# EAGLE board Analog_V7 (EAGLE 9.6.2)
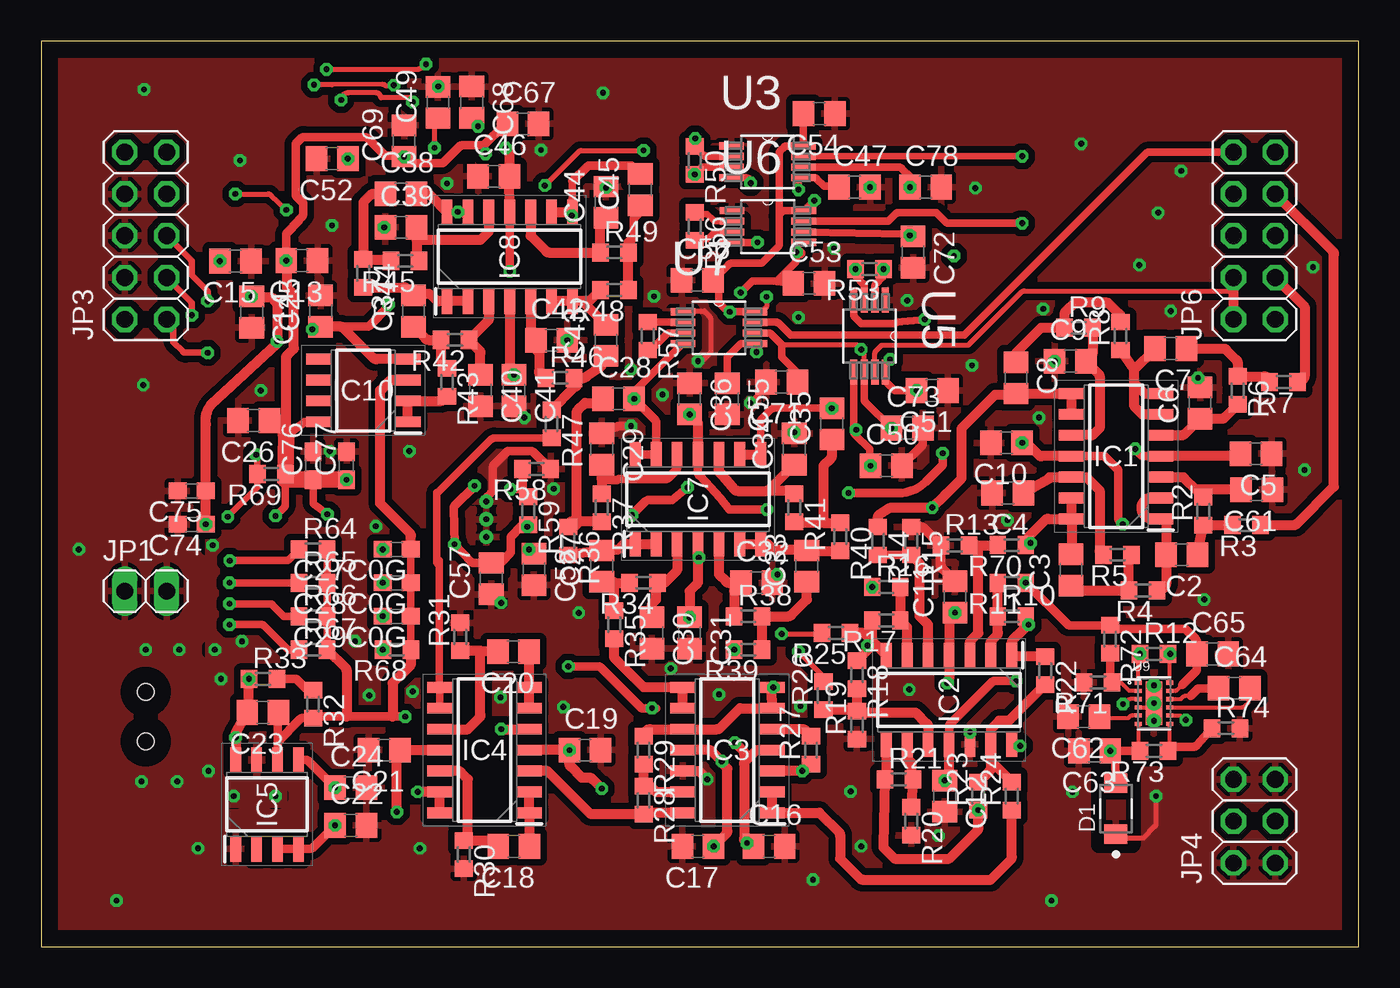
[diagram p1: board, top side]
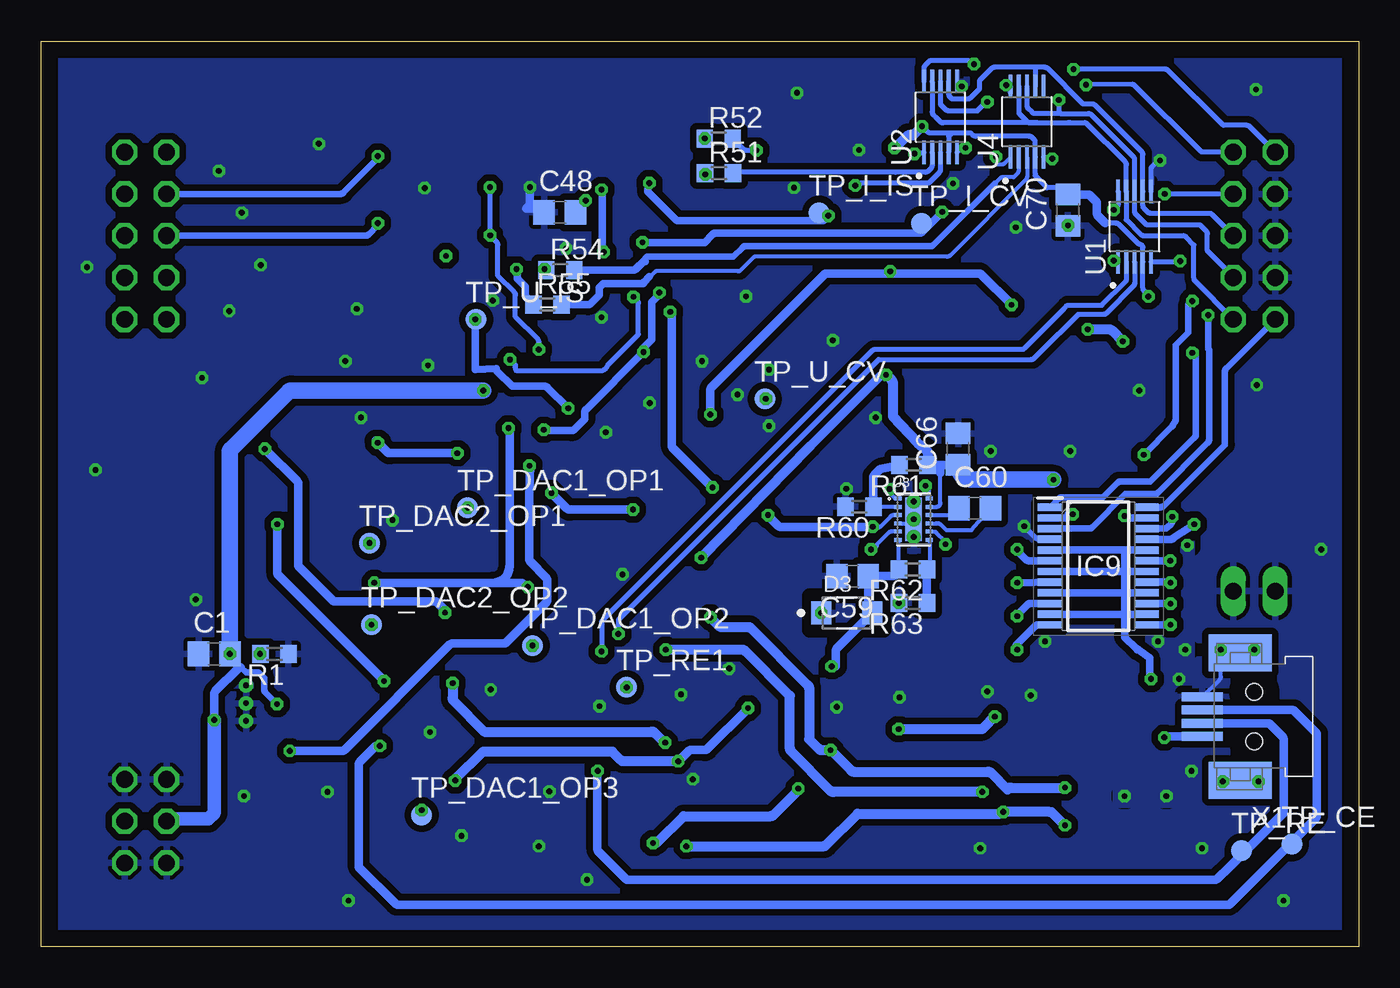
[diagram p2: board, bottom side, seen from below]

Size 80 x 55 mm. Coordinates in mm from the lower left corner, seen from the top.
Outline: 0,0 80,0 80,55 0,55 0,0
Copper layers (1*16): Top 0.035mm / dielectric 1.5mm / Bottom 0.035mm
Design rules "default": minimum track width 6mil, minimum drill 0.35mm, track to track 6mil, track to pad 6mil, pad to pad 6mil, via to via 6mil, smd to smd 6mil, copper to edge 40mil, drill to drill 6mil, minimum pad ring 10mil, minimum via ring 8mil, stop-mask expansion 4mil, vias tented up to drill 0mil, thermal gap 10mil

## Footprints (pad centres in the part's own frame; a part is rotated, then mirrored left to right if it is on the bottom)
C0805 = smd 1.3 x 1.5: 1 -0.95,0; 2 0.95,0
C0603 = smd 1.1 x 1: 1 -0.85,0; 2 0.85,0
ON_SEMICONDUCTOR_S310FA_0 = smd 1.2 x 1.4: 1 -1.55,0; 2 1.55,0
SOIC127P600X175-14N = smd 1.525 x 0.65: 1 -2.712,3.81; 2 -2.712,2.54; 3 -2.712,1.27; 4 -2.712,0; 5 -2.712,-1.27; 6 -2.712,-2.54; 7 -2.712,-3.81; 8 2.712,-3.81; 9 2.712,-2.54; 10 2.712,-1.27; 11 2.712,0; 12 2.712,1.27; 13 2.712,2.54; 14 2.712,3.81
SOIC127P600X175-8N = smd 1.525 x 0.65: 1 -2.712,1.905; 2 -2.712,0.635; 3 -2.712,-0.635; 4 -2.712,-1.905; 5 2.712,-1.905; 6 2.712,-0.635; 7 2.712,0.635; 8 2.712,1.905
SOP65P640X120-24N = smd 1.475 x 0.45: 1 -2.938,3.575; 2 -2.938,2.925; 3 -2.938,2.275; 4 -2.938,1.625; 5 -2.938,0.975; 6 -2.938,0.325; 7 -2.938,-0.325; 8 -2.938,-0.975; 9 -2.938,-1.625; 10 -2.938,-2.275; 11 -2.938,-2.925; 12 -2.938,-3.575; 13 2.938,-3.575; 14 2.938,-2.925; 15 2.938,-2.275; 16 2.938,-1.625; 17 2.938,-0.975; 18 2.938,-0.325; 19 2.938,0.325; 20 2.938,0.975; 21 2.938,1.625; 22 2.938,2.275; 23 2.938,2.925; 24 2.938,3.575
1X02 = drill 1.016 long: 1 -1.27,0; 2 1.27,0
2X05 = drill 1.016 octagon: 1 -5.08,-1.27; 2 -5.08,1.27; 3 -2.54,-1.27; 4 -2.54,1.27; 5 0,-1.27; 6 0,1.27; 7 2.54,-1.27; 8 2.54,1.27; 9 5.08,-1.27; 10 5.08,1.27
2X03 = drill 1.016 octagon: 1 -2.54,-1.27; 2 -2.54,1.27; 3 0,-1.27; 4 0,1.27; 5 2.54,-1.27; 6 2.54,1.27
R0603 = smd 1 x 1.1: 1 -0.85,0; 2 0.85,0
B1,27 = smd 1.27 x 1.27: TP 0,0
SOP50P490X110-10N = smd 1.44 x 0.3: 1 -2.145,1; 2 -2.145,0.5; 3 -2.145,0; 4 -2.145,-0.5; 5 -2.145,-1; 6 2.145,-1; 7 2.145,-0.5; 8 2.145,0; 9 2.145,0.5; 10 2.145,1
SOP65P490X110-8N = smd 1.499 x 0.432: 1 -2.184,0.965; 2 -2.184,0.33; 3 -2.184,-0.33; 4 -2.184,-0.965; 5 2.184,-0.965; 6 2.184,-0.33; 7 2.184,0.33; 8 2.184,0.965
VREG_LM27762DSSR = smd 0.5 x 0.25: 1 -0.95,1.25; 2 -0.95,0.75; 3 -0.95,0.25; 4 -0.95,-0.25; 5 -0.95,-0.75; 6 -0.95,-1.25; 7 0.95,-1.25; 8 0.95,-0.75; 9 0.95,-0.25; 10 0.95,0.25; 11 0.95,0.75; 12 0.95,1.25 | smd 1 x 2.65: 13 0,0 | drill 0.35 pad 0.61: 13.1 0,1.075; 13.2 0,0; 13.3 0,-1.075
32005-101 = smd 2.5 x 0.55: 1 3.15,1.2; 2 3.15,0.4; 3 3.15,-0.4; 4 3.15,-1.2 | smd 3.8 x 2.25: M1 0.85,3.875; M2 0.85,-3.875 | hole 1: 0,1.5; 0,-1.5

## Placement (x,y rotation side)
C1  Cvin  [C0805]  69.49,17.78 0 bottom
C2  110pF  [C0805]  69.25,23.8 180 top
C3  100pF  [C0805]  62.53,22.88 90 top
C4  10pF  [C0805]  58.68,27.56 180 top
C5  100nF  [C0805]  73.76,29.94 180 top
C6  11pF  [C0805]  70.36,33.02 90 top
C7  [C0805]  68.58,36.32 180 top
C8  100pF  [C0805]  59.18,34.54 270 top
C9  10pF  [C0805]  62.48,35.56 0 top
C10  100nF  [C0805]  58.61,30.6 180 top
C11  100nF  [C0805]  55.48,21.23 90 top
C12  100nF  [C0805]  54.86,9.14 270 top
C13  100nF  [C0805]  15.83,41.67 180 top
C14  100nF  [C0805]  12.78,38.54 270 top
C15  1uF  [C0805]  11.79,41.64 180 top
C16  100nF  [C0805]  44.2,6.1 0 top
C17  100nF  [C0805]  39.88,6.1 180 top
C18  100nF  [C0805]  28.7,6.1 180 top
C19  100nF  [C0805]  33.02,11.94 0 top
C20  100nF  [C0805]  28.68,17.91 180 top
C21  100nF  [C0805]  20.83,11.94 180 top
C22  100nF  [C0805]  18.8,7.37 0 top
C23  [C0805]  13.46,14.22 180 top
C24  100nF  [C0805]  18.8,9.65 0 top
C25  100nF  [C0805]  16.97,38.61 90 top
C26  [C0805]  12.9,31.95 180 top
C27  110PF  [C0805]  34.04,23.11 90 top
C27C0G  2.4nf  [C0603]  21.59,24.13 180 top
C28  100P  [C0805]  35.05,33.27 0 top
C28C0G  24pf  [C0603]  21.59,22.1 180 top
C29  10P  [C0805]  34.04,30.23 270 top
C29C0G  2.4p  [C0603]  21.59,20.07 180 top
C30  11pF  [C0805]  37.08,19.05 270 top
C31  100nF  [C0805]  39.37,19.05 270 top
C32  11pF  [C0805]  43.43,22.1 0 top
C33  110pF  [C0805]  46.48,23.11 90 top
C34  10pF  [C0805]  45.72,30.23 90 top
C35  100pF  [C0805]  48.01,31.75 90 top
C36  100nF  [C0805]  39.37,33.27 270 top
C37  110PF  [C0805]  22.61,38.61 90 top
C38  100P  [C0805]  21.84,45.72 0 top
C39  10P  [C0805]  21.84,43.69 0 top
C40  11pF  [C0805]  26.67,33.78 270 top
C41  100nF  [C0805]  28.7,33.78 270 top
C42  11pF  [C0805]  30.99,36.83 0 top
C43  110pF  [C0805]  34.29,36.83 90 top
C44  10pF  [C0805]  34.29,45.21 90 top
C45  100pF  [C0805]  36.37,45.97 90 top
C46  100nF  [C0805]  27.48,46.79 0 top
C47  100nF  [C0805]  49.38,46.13 0 top
C48  [C0805]  48.51,44.6 0 bottom
C49  1uF  [C0805]  24.09,51.27 90 top
C50  100nF  [C0805]  51.31,29.21 0 top
C51  [C0805]  54.1,33.78 180 top
C52  1uF  [C0805]  17.67,47.86 180 top
C53  100nF  [C0805]  46.61,40.28 0 top
C54  100nF  [C0805]  47.24,50.6 180 top
C55  100nF  [C0805]  41.66,33.27 270 top
C56  100nF  [C0805]  39.83,40.48 0 top
C57  Cvin  [C0805]  27.33,22.35 90 top
C58  [C0805]  29.92,22.91 270 top
C59  [C0805]  30.73,22.5 180 bottom
C60  [C0805]  23.32,26.62 0 bottom
C61  100nF  [C0805]  73.8,27.75 180 top
C62  [C0805]  63.3,13.97 180 top
C63  [C0805]  63.96,11.89 180 top
C64  [C0805]  72.44,15.7 0 top
C65  [C0805]  71.12,17.78 0 top
C66  [C0805]  24.33,30.23 90 bottom
C67  100nF  [C0805]  29.25,49.97 0 top
C68  100nF  [C0805]  26.14,51.29 270 top
C69  100nF  [C0805]  22.03,48.93 90 top
C70  100nF  [C0805]  17.67,44.74 90 bottom
C71  100nF  [C0805]  44.96,34.29 180 top
C72  100nF  [C0805]  52.93,42.19 270 top
C73  100nF  [C0805]  52.58,31.5 0 top
C74  0.1uf  [C0603]  9.14,25.65 180 top
C75  10uf  [C0603]  9.14,27.69 180 top
C76  0.1uf  [C0603]  16.51,29.21 90 top
C77  10uf  [C0603]  18.54,29.21 90 top
C78  100nF  [C0805]  53.7,46.13 0 top
D1  ON_SEMICONDUCTOR_S310FAON_SEMICONDUCTOR_S310FA_0_0  [ON_SEMICONDUCTOR_S310FA_0]  65.25,8.38 90 top
D3  ON_SEMICONDUCTOR_S310FAON_SEMICONDUCTOR_S310FA_0_0  [ON_SEMICONDUCTOR_S310FA_0]  31.09,20.27 0 bottom
IC1  AD8618ARZ  [SOIC127P600X175-14N]  65.27,29.79 180 top
IC2  AD8618ARZ  [SOIC127P600X175-14N]  55.12,14.99 270 top
IC3  AD8618ARZ  [SOIC127P600X175-14N]  41.66,11.94 180 top
IC4  AD8618ARZ  [SOIC127P600X175-14N]  26.92,11.94 180 top
IC5  ADA4530-1ARZ  [SOIC127P600X175-8N]  13.72,8.64 90 top
IC7  AD8618ARZ  [SOIC127P600X175-14N]  39.88,27.18 90 top
IC8  AD8618ARZ  [SOIC127P600X175-14N]  28.45,41.91 90 top
IC9  ADG714BRUZ  [SOP65P640X120-24N]  15.81,23.11 0 bottom
IC10  AD8616ARZ  [SOIC127P600X175-8N]  19.56,33.78 180 top
JP1  [1X02]  6.35,21.59 0 top
JP3  [2X05]  6.35,43.18 90 top
JP4  [2X03]  73.66,7.62 90 top
JP6  [2X05]  73.66,43.18 90 top
R1  0R  [R0603]  65.84,17.78 180 bottom
R2  93.1K  [R0603]  70.56,26.45 90 top
R3  2.67K  [R0603]  73.18,25.6 180 top
R4  4.22K  [R0603]  66.89,21.64 180 top
R5  57.6K  [R0603]  65.35,23.8 180 top
R6  93.1K  [R0603]  72.64,33.78 270 top
R7  2.67K  [R0603]  75.44,34.29 180 top
R8  4.22K  [R0603]  65.53,37.08 90 top
R9  57.6K  [R0603]  62.99,37.59 0 top
R10  1K  [R0603]  58.93,20.07 0 top
R11  1K  [R0603]  58.93,22.1 180 top
R12  Rpu  [R0603]  67.56,17.78 0 top
R13  1K  [R0603]  55.47,24.36 0 top
R14  1K  [R0603]  50.8,24.64 270 top
R15  1K  [R0603]  52.83,24.64 270 top
R16  1K  [R0603]  51.31,21.84 0 top
R17  1K  [R0603]  51.31,19.81 180 top
R18  1K  [R0603]  49.53,16.51 270 top
R19  1K  [R0603]  49.53,13.46 90 top
R20  1K  [R0603]  52.83,7.62 270 top
R21  1K  [R0603]  52.07,10.16 0 top
R22  1K  [R0603]  60.96,16.76 270 top
R23  1K  [R0603]  56.9,9.14 90 top
R24  1K  [R0603]  58.93,9.14 90 top
R25  0R  [R0603]  48.26,19.05 180 top
R26  0R  [R0603]  47.5,15.24 90 top
R27  0R  [R0603]  46.74,11.94 90 top
R28  [R0603]  36.58,8.89 270 top
R29  [R0603]  36.58,11.94 270 top
R30  1K  [R0603]  25.65,5.59 270 top
R31  1K  [R0603]  25.44,18.81 90 top
R32  10K  [R0603]  16.51,14.73 270 top
R33  10K  [R0603]  13.46,16.26 0 top
R34  93.1K  [R0603]  36.58,22.1 180 top
R35  2.67K  [R0603]  34.8,19.56 270 top
R36  4.22K  [R0603]  32,24.64 270 top
R37  57.6K  [R0603]  34.04,26.67 270 top
R38  93.1K  [R0603]  42.93,20.07 0 top
R39  2.67K  [R0603]  42.93,18.03 180 top
R40  4.22K  [R0603]  48.51,24.89 270 top
R41  57.6K  [R0603]  45.72,26.67 270 top
R42  93.1K  [R0603]  25.12,36.85 180 top
R43  2.67K  [R0603]  24.64,34.29 270 top
R44  4.22K  [R0603]  19.56,40.89 270 top
R45  57.6K  [R0603]  22.1,41.66 180 top
R46  93.1K  [R0603]  31.5,34.54 0 top
R47  2.67K  [R0603]  30.99,31.75 270 top
R48  4.22K  [R0603]  34.8,39.88 180 top
R49  57.6K  [R0603]  34.8,42.16 0 top
R50  1K  [R0603]  39.67,47.75 270 top
R51  0R  [R0603]  38.84,46.98 0 bottom
R52  0R  [R0603]  38.86,49.09 0 bottom
R53  1K  [R0603]  50.29,41.15 180 top
R54  0R  [R0603]  48.48,41.09 0 bottom
R55  0R  [R0603]  49.27,38.99 0 bottom
R56  1K  [R0603]  39.67,43.74 270 top
R57  1K  [R0603]  36.83,37.08 270 top
R58  0R  [R0603]  30.07,29.01 180 top
R59  Rpu  [R0603]  29.57,26.47 270 top
R60  [R0603]  30.33,26.72 180 bottom
R61  [R0603]  27.03,29.26 180 bottom
R62  [R0603]  27.08,22.91 180 bottom
R63  [R0603]  27.08,20.88 180 bottom
R64  100  [R0603]  16.51,24.13 0 top
R65  1k  [R0603]  16.51,22.1 0 top
R66  10k  [R0603]  16.51,20.07 0 top
R67  100k  [R0603]  16.51,18.03 0 top
R68  1M  [R0603]  21.59,18.03 180 top
R69  4.7k  [R0603]  13.97,28.7 180 top
R70  1K  [R0603]  58.93,24.38 180 top
R71  [R0603]  64.16,16.05 180 top
R72  [R0603]  64.9,18.67 270 top
R73  [R0603]  67.56,11.89 180 top
R74  [R0603]  71.94,13.26 0 top
TP_CE  TPB1,27  [B1,27]  4.06,6.22 0 bottom
TP_DAC1_OP1  TP_DAC1_OP1  [B1,27]  54.1,26.67 0 bottom
TP_DAC1_OP2  TPB1,27  [B1,27]  50.16,18.29 0 bottom
TP_DAC1_OP3  TPB1,27  [B1,27]  56.9,8 0 bottom
TP_DAC2_OP1  TP_DAC2_OP1  [B1,27]  60.07,24.51 0 bottom
TP_DAC2_OP2  TP_DAC2_OP2  [B1,27]  59.94,19.56 0 bottom
TP_I_CV  TPB1,27  [B1,27]  26.54,43.94 0 bottom
TP_I_IS  TPB1,27  [B1,27]  32.77,44.58 0 bottom
TP_RE  TPB1,27  [B1,27]  7.11,5.84 0 bottom
TP_RE1  TPB1,27  [B1,27]  44.45,15.75 0 bottom
TP_U_CV  TPB1,27  [B1,27]  36.07,33.27 0 bottom
TP_U_IS  TPB1,27  [B1,27]  53.59,38.1 0 bottom
U1  EVAL-AD5270SDZ  [SOP50P490X110-10N]  13.61,43.74 90 bottom
U2  EVAL-AD5270SDZ  [SOP50P490X110-10N]  25.4,50.39 90 bottom
U3  AD8421ARMZ  [SOP65P490X110-8N]  44.1,47.67 0 top
U4  EVAL-AD5270SDZ  [SOP50P490X110-10N]  20.15,50.11 90 bottom
U5  AD8421ARMZ  [SOP65P490X110-8N]  50.29,37.08 270 top
U6  AD8421ARMZ  [SOP65P490X110-8N]  44.12,43.74 0 top
U7  AD8421ARMZ  [SOP65P490X110-8N]  41.15,37.59 0 top
U8  LM27762DSSR  [VREG_LM27762DSSR]  27.03,25.96 0 bottom
U9  LM27762DSSR  [VREG_LM27762DSSR]  67.56,14.78 0 top
X1  MINI-USB_SHIELD4P-32005-101  [32005-101]  6.35,13.97 180 bottom

## Tracks (layer width: path | path; a pad name or v marks a point on that pad's centre or on a via)
+1.65V  (via drill 0.35)
  Top 0.254: U9.11 68.82,15.53 arc45 69,15.61 69.29,15.9
  Top 0.305: U5.6 49.96,36.04 arc45 49.89,36.22 | 49.89,36.22 49.58,36.52 45.09,36.52 arc45 44.96,36.47 | 49.89,36.22 arc-45 49.8,36.25 v49.79,36.27
  Top 0.457: C71.1 45.91,34.76 arc45 45.83,34.94 44.96,35.81 44.96,36.47 arc45 44.88,36.65 44.35,37.19 arc45 44.17,37.26 U7.6 | U5.6 49.96,33.27 arc45 50.04,33.09 C73.1 | U6.6 52.56,43.28 arc-45 v52.74,43.21 C72.1 | U3.6 52.07,47.34 arc-45 52.25,47.27 52.78,46.74 52.78,46.21 arc-45 C78.1
  Top 0.508: 69.29,15.9 70.1,16.7 arc45 70.17,16.88 C65.1 70.17,18.5 arc45 70.1,18.68 69.47,19.3 65.22,19.3 arc-45 65.04,19.38 R72.1 62.46,19.52 arc-45 62.28,19.59 R11.1
  Bottom 0.305: v49.79,36.27 49.79,36.73 arc-45 49.86,36.91 51.21,38.25 51.21,39.57 arc-45 51.28,39.75 52.27,40.74 52.27,42.62 arc-45 52.35,42.8 52.88,43.33 arc45 52.88,43.33 v52.74,43.21 52.74,46.16 arc45 52.73,46.18 arc-45 C78.1
  Bottom 0.508: R11.1 52.58,22.1 | 52.58,22.1 50.91,22.1 arc45 50.73,22.02 50.42,21.72 50.42,21.75 arc-45 R16.1 | 52.58,22.1 arc-90 51.56,23.11 51.56,31.5 C73.1
  other vias: 52.75,46.13 59.78,22.1 50.46,21.84 51.63,31.5
+2.5V  (via drill 0.35)
  Top 0.305: v26.98,48.16 26.98,48.46 arc45 26.9,48.64 26.87,48.67
  Top 0.457: v14.22,26.16 14.75,26.68 arc45 14.82,26.86 14.82,28.4 R69.1 | v17.37,26.26 16.58,26.85 arc-45 16.51,27.03 16.51,28.35 C76.1
  Top 0.508: IC5.5 16.05,11.35 arc-45 16.22,11.27 C24.1 | IC10.8 16.09,31.88 arc45 15.91,31.8 14.87,31.02 | C13.2 14.88,43.24 arc-45 14.94,43.38 15.61,44.06 arc45 15.65,44.15 15.83,44.33 arc45 15.9,44.5 15.9,45.16 15.52,45.54 arc-45 15.44,45.72 15.44,48.77 15.78,49.1 arc-45 15.96,49.17 19.66,49.17 arc-45 19.84,49.1 20.88,48.06 21.86,48.06 arc-45 C69.1 22.34,47.67 arc45 22.52,47.6 24.38,47.6 25.38,48.59 arc-45 25.56,48.67 26.87,48.67 28.11,49.9 arc-45 28.29,49.97 C67.1 | v39.93,23.62 arc-45 39.88,23.75 IC7.4 | IC1.4 66.96,29.79 arc-45 66.78,29.86 v66.42,30.23
  Top 0.61: C5.2 arc-90 72.66,29.79 IC1.4 | C11.1 55.19,20 arc45 55.12,19.82 IC2.4 55.12,16.26 arc-45 55.04,16.08 54.97,16 v55.02,16 | C16.1 v42.85,6.29 42.75,6.39 arc-45 42.67,6.57 42.67,11.07 | 42.67,11.07 arc-45 42.75,11.25 43.43,11.94 IC3.4 | IC4.4 C19.1 32.07,11.11 arc45 32.14,10.93 32.82,10.26 33.27,10.26 arc-45 33.45,10.19 v34.04,9.6 | IC8.4 28.45,35.09 arc45 28.52,34.91 C41.1 | C31.1 39.37,21.59 39.8,22.02 arc45 39.88,22.2 IC7.4 | v42.11,12.39 42.6,11.91 arc-45 42.67,11.73 42.67,11.07 | 14.87,31.02 14.87,35.75 arc-45 14.95,35.93 15.31,36.29 arc45 15.34,36.37 15.34,39.52 arc45 15.27,39.7 14.94,40.03 14.94,41.43 arc45 C13.2
  Top 1.016: C77.1 16.52,28.36 arc90 16.51,28.35 | C76.1 14.86,28.36 arc-90 14.82,28.4 | R69.1 14.87,31.02 arc90 C26.1
  Bottom 0.254: U8.11 25.65,26.71 arc-90 25.4,26.96 25.4,28.75 | U4.1 21.54,47.57 arc45 21.71,47.5 21.97,47.5 21.97,47.88 arc-45 22,47.95 C69.1
  Bottom 0.305: U1.1 arc-45 14.66,41.61 C13.2 | U2.1 arc45 26.5,48.21 27.03,48.21 v26.98,48.16
  Bottom 0.457: IC9.23 13.99,26.04 arc45 14.17,26.11 v14.22,26.16 | IC9.2 17.76,26.04 arc-45 17.58,26.11 17.63,26.26 v17.37,26.26
  Bottom 0.508: 25.4,28.75 25.4,29.01 arc-90 25.65,29.26 R61.1 24.35,29.26 arc-90 C66.1 | 33.32,30.38 29.05,34.66 arc45 28.87,34.73 C41.1 | v66.42,30.23 64.46,28.27 arc45 64.39,28.09 64.39,23.11 62.3,21.03 arc-45 62.12,20.95 56.01,20.95 55.37,20.32 arc45 55.46,20.28 C11.1
  Bottom 0.61: C41.1 28.37,34.4 arc45 28.3,34.22 28.3,32.21 26.8,30.61 26.25,30.16 arc45 26.18,29.98 R61.1 | v39.93,23.62 33.32,30.38 | C31.1 38.85,19.48 arc-45 38.67,19.41 37.05,19.41 arc45 36.93,19.36 33.45,15.87 arc45 33.38,15.69 33.38,12.6 32.79,12.01 arc-45 32.61,11.94 C19.1 30.82,10.69 arc-45 30.64,10.62 22.51,10.62 arc45 22.33,10.54 21.34,9.55 21.31,9.58 arc45 21.13,9.65 C24.1 | v42.85,6.29 42.73,6.29 arc-45 42.55,6.37 41,7.92 35.72,7.92 arc-45 35.54,8 34.11,9.43 arc-45 v34.04,9.6 | v55.02,16 55.02,15.09 arc-45 54.94,14.91 53.09,13.06 42.93,13.06 arc45 42.75,12.98 42.2,12.43 arc-45 v42.11,12.39
  Bottom 1.016: C77.1 23.45,28.36 arc90 24.35,29.26
  other vias: 18.54,28.36 14.88,41.67 28.7,34.73 39.37,20 32.07,11.94 17.85,9.65 55.48,20.28 22.03,47.98
+5V  (via drill 0.35)
  Top 0.254: v29.52,25.5 29.52,25.51 arc45 29.54,25.59 R59.2 | U9.12 68.51,17.68 arc90 R12.2 | U9.8 69.07,14.03 arc-45 69.25,13.96 69.34,13.87 arc-45 69.43,13.83 v69.49,13.77 | U9.3 66.14,15.03 arc45 65.96,14.96 65.73,14.73 v65.68,14.73
  Top 0.305: U5.8 51.26,35.31 arc-90 51.71,35.76 51.64,35.76 arc90 v51.54,35.66 | v44.04,39.47 44.04,38.86 43.81,38.63 arc-45 43.63,38.56 42.98,38.56
  Top 0.457: U7.8 42.98,38.56 v41.81,38.56 arc-45 41.63,38.63 41.15,39.12 41.15,40.31 arc45 41.07,40.49 C56.2 41.73,41.43 arc-45 41.91,41.5 43.74,41.5 44.73,42.5 arc45 44.81,42.68 44.81,44.34 | U5.8 51.26,34.45 arc45 51.33,34.27 51.82,33.78 C51.2 | 44.81,44.34 arc-45 44.88,44.52 45.01,44.65 arc-45 45.13,44.7 U6.8 arc45 46.35,44.72 v46.94,45.31 | 44.81,44.34 44.81,48.16 arc-45 44.88,48.33 45.11,48.56 arc-45 45.29,48.63 U3.8 46.28,50.58 arc-90 C54.2
  Top 0.508: R59.2 29.33,25.62 arc45 29.15,25.54 28.5,24.89 28.5,23.93 27.95,23.38 arc-45 27.77,23.3 C57.2 26.28,23.3 arc-45 26.1,23.38 v25.09,24.43 25.04,26.62 arc-45 25.12,26.8 v26.31,27.99 | R12.2 C1.2 | v35.87,26.21 36.7,27.05 arc-45 36.88,27.13 38.3,27.13 39.19,27.87 arc-45 39.35,27.81 v39.24,27.89 39.37,27.94
  Bottom 0.254: U8.3 28.25,26.21 arc-45 28.43,26.13 29.03,25.52 arc45 29.21,25.45 29.52,25.45 arc-45 29.6,25.41 v29.52,25.5 | U8.8 25.82,25.21 arc45 25.64,25.13 25.15,24.64 v25.09,24.43 | U8.12 26.08,28.01 arc-90 26.11,28.04 26.26,28.04 arc-90 v26.31,27.99
  Bottom 0.305: v51.54,35.66 51.21,35.33 arc-45 51.16,35 45.9,35 arc-45 45.59,35.33 43.74,37.19 43.74,39.06 arc-45 43.81,39.24 v44.04,39.47
  Bottom 0.406: v65.68,14.73 66.37,15.42 arc45 66.45,15.6 66.45,16.2 arc-45 66.52,16.38 66.73,16.59 arc-45 66.91,16.66 67.56,16.66 67.87,16.97 68.47,17.57 arc45 68.54,17.75 C1.2
  Bottom 0.457: C48.2 47.02,45.15 arc-45 46.99,45.21 46.98,45.23 arc-45 v46.94,45.31
  Bottom 0.508: v69.49,13.77 69.49,15.34 arc45 69.42,15.52 68.04,16.89 arc45 67.87,16.97 | v29.52,25.5 35.1,25.5 arc45 35.28,25.58 35.83,26.13 arc45 v35.87,26.21 | v39.24,27.89 41.63,30.25 arc45 41.71,30.43 41.71,38.56 v41.81,38.56
  Bottom 0.813: JP4.4 72.34,7.67 arc45 72.16,7.75 69.85,7.75 69.57,8.03 arc-45 69.49,8.21 v69.49,13.77
  Bottom 1.016: C1.2 68.54,30.03 arc45 68.47,30.21 64.97,33.71 arc45 64.79,33.78 C51.2
  other vias: 68.54,17.78 53.15,33.78
-2.5V  (via drill 0.35)
  Top 0.305: C68.2 arc-45 26.19,50.32 26.57,49.94 arc-45 26.53,49.84 v26.52,49.83 | 14.33,36.63 v14.33,36.76
  Top 0.508: IC5.3 IC5.4 16.3,5.92 arc45 16.48,6 C22.1 | IC2.11 55.12,13.36 arc-45 55.19,13.54 57.71,16.05 arc-45 57.89,16.13 v59.18,16.13 | v65.66,25.65 65.48,25.83 arc-45 65.41,26.01 65.41,28.96 64.64,29.72 arc45 64.47,29.79 IC1.11 | v28.45,41.02 IC8.11 | C25.1 19.77,37.66 arc45 19.95,37.73 21.08,38.86 v21.08,38.99 | IC7.11 39.88,28.81 arc45 39.95,28.63 40.01,28.57 arc-8 41.78,26.54 v44.07,26.54 44.2,26.54 | v49.02,27.56 52.09,27.56 arc45 53.7,28.23 54.74,29.26 v54.74,29.97 | v32,17.02 33.8,17.02 arc-45 33.98,16.94 36.45,14.48 v37.08,14.48 37.34,14.48
  Top 0.61: C10.1 59.72,30.6 arc-45 59.9,30.53 60.56,29.86 arc45 60.74,29.79 IC1.11 | C17.1 41.58,6.85 arc45 41.66,7.03 41.66,10.82 41.4,11.07 arc-45 v41.33,11.25 40.71,11.86 arc45 40.53,11.94 IC3.11 | IC4.11 C21.1 21.66,11.82 arc45 21.59,11.64 v21.59,8.18 | IC8.11 C46.2 28.43,48.17 arc45 28.36,48.35 v28.19,48.51 | IC7.11 39.88,31.71 arc45 39.8,31.89 C36.2 | C12.1 55.04,10.27 arc45 55.12,10.45 IC2.11 | C74.1 C75.1 9.99,31.73 arc-45 10.32,32.93 14.33,36.63 | v14.33,36.76 14.33,39.01 arc45 14.25,39.19 14.02,39.42 12.94,39.42 arc-45 C14.1 | C25.1 18.17,37.66 arc-45 18.35,37.58 20.17,35.76 arc45 20.35,35.69 IC10.4
  Bottom 0.254: U8.6 27.98,23.03 arc-45 R62.2
  Bottom 0.305: C14.1 13.04,39.82 arc45 13.11,40 U1.4 13.11,42.47 arc-45 13.16,42.57 13.18,42.6 arc-45 13.36,42.67 14.56,43.87 arc-45 14.74,43.94 15.39,43.94 | C70.2 17.67,45.7 arc-45 17.74,45.88 17.98,46.13 18.83,46.13 arc-45 18.95,46.08 arc-45 18.98,46.16 19.66,46.84 19.66,46.99 U4.4 arc45 19.66,48 19.66,48.9 arc-45 19.71,49.02 19.84,49.15 arc-45 20.02,49.23 23.26,49.23 arc45 23.44,49.3 23.57,49.43 24.58,49.43 | 24.58,49.43 arc-45 24.76,49.35 24.89,49.23 arc-45 24.9,49.21 U2.4 | v26.52,49.83 26.19,49.5 arc-45 26.01,49.43 24.58,49.43
  Bottom 0.457: C74.1 11.18,24.89 11.26,24.81 arc45 11.44,24.74 IC9.21
  Bottom 0.508: R62.2 arc90 28.33,22.5 C59.1 29.78,20.51 arc-90 D3.2 31.68,18.13 arc-45 31.75,17.95 31.75,17.02 v32,17.02 | 15.39,43.94 15.83,44.38 arc45 15.9,44.55 15.9,45.21 16.3,45.62 arc-45 16.48,45.69 C70.2 | v59.18,16.13 65.58,22.53 arc45 65.66,22.71 v65.66,25.65 | C36.2 39.37,33.8 arc45 39.3,33.98 32.46,40.82 arc45 32.28,40.89 28.45,40.89 | 28.45,40.89 v28.45,41.02 | v21.08,38.99 22.91,40.82 arc-45 23.09,40.89 28.45,40.89 | v44.07,26.54 47.9,26.54 arc45 48.08,26.62 v49.02,27.56 | v54.74,29.97 58.82,29.97 arc45 59,30.05 59.69,30.73 arc-45 59.69,30.73 C10.1 | v37.08,14.48 39.55,12.01 arc45 39.73,11.94 40.53,11.94 arc-45 40.71,11.86 v41.33,11.25
  Bottom 0.61: C17.1 32.52,6.1 arc-45 32.34,6.17 30.43,8.08 21.8,8.08 arc-45 21.62,8.15 v21.59,8.18 18.76,8.18 arc45 18.58,8.1 C22.1 | v41.33,11.25 44.62,11.25 arc45 44.8,11.33 45.31,11.84 53.08,11.84 arc-45 53.26,11.76 54.82,10.21 arc-45 C12.1 | v26.52,49.83 27,49.35 arc45 27.18,49.28 27.38,49.28 28.11,48.55 arc45 v28.19,48.51 | v14.33,36.76 14.98,37.42 arc-45 15.16,37.49 v16.46,37.49 16.51,37.49
  other vias: 9.99,25.65 12.78,39.49 40.83,6.1 17.85,7.37 54.86,10.09 39.37,32.32 59.56,30.6
-5V  (via drill 0.35)
  Top 0.254: U9.6 66.61,12.11 arc-45 66.54,11.93 66.5,11.89
  Top 0.457: C55.1 41.66,35.81 42.39,36.55 arc-45 42.57,36.63 U7.5 43.33,36.33 arc45 43.41,36.15 v43.43,36.12 43.48,36.07 | 49.33,31.3 U5.5 | 49.33,31.3 arc45 49.4,31.12 50.29,30.23 50.29,29.37 arc45 C50.1 | v45.97,45.97 45.97,46.4 arc-90 U3.5 46.92,46.7 arc-45 47.1,46.63 47.55,46.18 48.3,46.18 arc-45 C47.1 | U6.5 arc90 45.85,42.32 v45.85,42.19 45.85,41.74 arc-45 45.77,41.56 44.65,40.44 43.28,40.44 arc45 43.11,40.36 v42.47,39.73 | v49.48,31.39 49.53,31.39 arc45 49.35,31.32 49.33,31.3
  Top 0.508: R73.2 66.5,11.89 C63.1 65.13,11.67 arc-45 65.2,11.49 D1.2 | 44.65,40.44 45.84,40.27 arc-45 45.91,40.34 C53.1
  Top 0.61: v45.85,42.19 45.93,42.19 arc-45 46.11,42.12
  Bottom 0.457: v45.85,42.19 arc45 45.92,42.37 45.92,45.87 arc-45 v45.96,45.96 v45.97,45.97 | v42.47,39.73 arc45 42.38,39.69 42.37,39.67 arc-45 42.45,39.64 42.93,39.16 42.93,36.88 43.36,36.45 arc-45 43.43,36.27 v43.43,36.12 46.92,32.64 arc-45 46.99,32.46 46.99,32.05 47.63,31.42 arc45 47.81,31.34 49.51,31.34 arc45 v49.48,31.39
  Bottom 0.508: C63.1 61.75,11.89 arc-45 61.57,11.96 55.19,18.34 arc45 55.01,18.41 51.82,18.41 49.35,20.88 arc-45 49.28,21.06 49.28,22.25 arc-45 49.35,22.43 50.29,23.36 | C50.1 50.34,29.23 arc-45 50.29,29.34 50.36,27.18 | 50.37,27 50.36,27.18 | 50.29,23.36 50.29,23.37 | 50.36,27.18 50.36,23.54 arc-45 50.29,23.36
  other vias: 64.91,11.89 50.36,29.21
CE  (via drill 0.35)
  Top 0.508: v59.44,12.19 59.12,12.19 arc-45 IC2.14
  Bottom 0.406: TP_CE.TP 4.13,6.29
  Bottom 0.508: X1.3 4.06,14.37 arc45 3.88,14.3 2.54,12.95 2.54,7.98 arc45 2.61,7.8 4.13,6.29 7.87,2.54 58.31,2.54 arc45 58.49,2.61 60.71,4.83 60.71,11.07 arc45 60.63,11.25 59.69,12.19 v59.44,12.19
DAC1
  Top 0.61: JP6.3 76.71,38.86 76.71,34.71 arc-90 R7.1
DAC1_OP1  (via drill 0.35)
  Top 0.61: IC1.9 IC1.8 59.69,33.6 | 59.69,33.6 59.2,33.6 arc45 C8.2 | R14.1 50.8,26.06 arc-45 50.87,26.24 51.56,26.67 TP_DAC1_OP1.TP 54.89,27.43 arc45 54.94,27.51 55.88,28.45 55.88,31.39 arc-45 55.95,31.57 57.91,33.53 59.52,33.53 arc45 59.69,33.6
  other vias: 54.1,26.67
DAC1_OP2  (via drill 0.35)
  Top 0.406: 50.57,18.44 50.42,18.44 arc45 50.24,18.36 TP_DAC1_OP2.TP
  Top 0.61: 50.53,18.47 50.57,18.44 IC2.7 | 50.53,18.47 arc-45 50.46,18.65 R17.2 | 50.53,18.47 50.03,18.98 arc45 49.85,19.05 R25.1 | R18.1 50.46,18.29 arc45 50.53,18.47
  other vias: 50.16,18.29
DAC1_OP3  (via drill 0.35)
  Top 0.61: IC2.8 51.31,10.43 arc-45 51.23,10.25 R21.1 51.13,6.13 arc45 51.2,5.95 51.82,5.33 55.12,5.33 56.82,7.04 arc45 56.9,7.22 R23.1
  Bottom 0.406: TP_DAC1_OP3.TP R23.1
  other vias: 56.9,8.29
DAC2
  Top 0.61: R3.1 76.04,25.6 arc45 76.22,25.67 78.49,27.94 78.49,42.06 arc45 78.41,42.24 JP6.7
DAC2_OP1  (via drill 0.35)
  Top 0.406: R70.1 59.83,24.44 arc-45 60.01,24.51 TP_DAC2_OP1.TP
  Top 0.61: C3.2 arc45 62.56,23.9 IC1.14 | IC1.14 IC1.13 | R70.1 59.95,24.79 arc-45 60.02,24.97 60.96,25.91 arc-45 61.13,25.98 IC1.14
  other vias: 60.07,24.51
DAC2_OP2  (via drill 0.35)
  Top 0.406: TP_DAC2_OP2.TP 59.94,19.8 arc45 59.87,19.97 R10.2
  Top 0.61: 58.93,17.78 58.93,18.44 arc-45 59,18.62 59.69,19.3 59.69,19.87 arc-45 59.76,20.05 R10.2 | 58.93,17.78 IC2.1 | R22.1 59.2,17.61 arc-45 59.02,17.69 58.93,17.78
  other vias: 59.94,19.56
GND  (via drill 0.35)
  Top 0.254: U9.4 67.21,14.53 arc45 67.39,14.61 U9.13.2 | v24.11,52.24 C49.2 | C32.2 44.38,22.18 arc-45 44.46,22.36 v44.7,22.61 | C57.1 27.8,20.93 arc45 R63.2
  Top 0.305: C6.2 70.36,34.31 arc45 70.28,34.49 v70.23,34.54 | D1.1 65.41,6.68 arc45 65.59,6.6 66.93,6.6 67.62,7.29 arc45 67.69,7.47 v67.69,9.14 | C71.2 44.01,34.08 arc-45 43.93,33.9 v43.05,33.02 | U7.1 arc-45 39.09,38.61 40.26,38.61 40.57,38.3 arc-45 40.64,38.12 40.64,36.07 40.21,35.63 arc-45 40.03,35.56 v39.88,35.56 | C44.2 v34.29,46.1
  Top 0.508: C41.2 29.29,32.24 arc-45 v29.34,32.13 | C29.1 34.92,31.55 arc-45 35.1,31.62 v35.81,31.62 | C39.1 v20.83,43.69 | U8.13.1 27.03,27.17 arc-45 27.1,27.35 27.43,27.69 27.43,29.11 arc-45 27.51,29.28 28.32,30.1 29.73,30.1 arc-45 29.91,30.02 R58.1 | C50.2 53.45,30.41 arc45 53.53,30.59 C73.2
  Top 0.61: C11.2 54.69,22.97 arc-45 54.62,23.15 R13.1 53.57,25.41 arc45 53.39,25.49 R15.1 | IC3.12 39.82,10.67 arc-45 40,10.59 v40.44,10.16 | IC2.12 v56.39,13.03
  Bottom 0.254: U8.4 27.38,25.71 arc-45 27.2,25.78 U8.13.2 | U2.6 arc45 24.3,52.5 24,52.2 arc45 24.1,52.24 v24.11,52.24 | X1.4 8.46,16.21 arc-45 8.38,16.39 v8.38,18.03
  Bottom 0.305: U1.6 12.61,47.22 arc45 12.54,47.4 12.19,47.75 v12.06,47.75 | IC9.4 19.43,24.74 arc45 19.6,24.81 v20.32,25.53
  Bottom 0.508: C70.1 C70.1 arc-45 v17.65,43.81 | C48.1 49.62,44.76 arc-45 49.8,44.83 50.55,44.83 50.4,44.98 arc-45 50.33,45.16 C47.2
  other vias: 2.29,24.13 31.11,27.81 35.81,35.05 30.35,48.39 52.58,39.24 56.52,35.31 60.83,38.73 60.58,32.13 58.67,25.91 52.7,15.62 49.78,6.1 46.86,4.06 66.67,41.4 68.58,38.61 77.22,41.27 67.82,44.58 69.22,47.12 76.71,28.96 70.61,21.08 62.61,9.4 54.48,6.73 13.34,33.78 22.35,30.1 17.53,30.1 45.72,31.24 37.72,33.53 31.94,36.83 37.21,39.5 24.64,46.35 22.99,5.97 9.53,5.97 4.57,2.79 61.34,2.79 32.64,20.27 38.23,16.89 46.1,14.61 6.35,18.03 8.26,10.03 6.1,10.03 50.33,46.13 45.97,38.23 48.13,42.42 61.53,35.56 27.93,20.88 6.2,34.11 6.25,52.07 19.91,15.27 22.56,15.49 27.89,15.14 31.7,14.55 41.15,15.32 49.15,9.42 34.11,51.87 56.72,46.08 63.14,48.77
  pour Top (isolate 0.406): 0,0 80.01,0 80.01,54.61 0,54.61
  pour Bottom (isolate 0.406): 0,0 0,54.61 80.01,54.61 80.01,0
GRD  (via drill 0.35)
  other vias: 10.54,18.03 14.22,9.14 11.68,9.14 10.16,10.67 10.92,16.26 12.19,18.54 10.41,24.38 19.05,18.54
  pour Top (isolate 0.406): 6.35,13.97 6.35,8.64 14.73,8.64 14.73,14.88 arc-45 14.81,15.06 15.49,15.75 17.27,17.53 20.83,17.53 20.83,25.65 10.16,25.65 10.16,18.29 10.16,13.97
  pour Bottom (isolate 0.406): 6.35,13.97 6.35,8.64 14.73,8.64 14.73,14.99 17.27,17.53 20.83,17.53 20.83,25.65 10.16,25.65 10.16,13.97
I1  (via drill 0.35)
  Top 0.406: 71.95,43.51 arc-45 72.13,43.44 JP6.6 | v59.56,43.94 59.51,43.99 arc45 59.33,44.07
  Top 0.457: U6.7 51.44,44.07 51.87,44.5 arc-45 52.05,44.58 54.36,44.58 54.92,44.02 arc45 55.1,43.94 v59.56,43.94
  Bottom 0.406: JP6.6 60.3,43.18 arc-45 60.12,43.25 59.56,43.81 v59.56,43.94
I2  (via drill 0.35)
  Top 0.406: v59.56,48.01 46.29,48.01 arc45 U3.7
  Bottom 0.406: JP6.8 61.83,45.72 arc-45 61.65,45.79 59.44,48.01 v59.56,48.01
I_CV_W/ODC
  Top 0.61: IC10.1 IC10.2 24.24,33.15 arc45 24.42,33.22 R43.2
I_CV_W/ODC_FILTER  (via drill 0.35)
  Top 0.457: IC8.14 v25.3,44.62 | v43.48,42.77 U6.4
  Top 0.61: v25.3,44.62 IC8.13 | C38.2 23.43,45.72 arc-45 23.61,45.65 IC8.14
  Bottom 0.406: v25.3,44.62 25.9,44.02 arc45 26.08,43.94 TP_I_CV.TP
  Bottom 0.457: v25.3,44.62 26.51,43.41 arc45 26.69,43.33 39.06,43.33 arc-45 39.24,43.26 39.73,42.77 v43.48,42.77
I_IS_W/ODC
  Top 0.457: IC4.9 IC4.8 arc-90 24.18,15.78 24.18,23.22 | 24.18,23.22 24.18,23.47 | 24.18,23.22 arc-90 24.03,23.37 24.03,27.58 arc45 24.11,27.62 27.29,30.8 arc-45 27.38,30.84 arc-45 27.54,30.9 R47.2
I_IS_W/ODC_FILTER  (via drill 0.35)
  Top 0.457: 32.26,46.48 v32.21,44.4 | v43.08,46.38 arc90 42.75,46.7 U3.4
  Top 0.508: C45.2 35.92,47.37 arc45 35.74,47.45 33.33,47.45 arc45 33.15,47.37 32.26,46.48
  Top 0.61: IC8.9 IC8.8 v32.21,44.4
  Bottom 0.406: TP_I_IS.TP arc-45 32.05,44.56 32.27,44.34
  Bottom 0.457: v43.08,46.38 arc90 43.13,46.33 43.18,45.87 41.48,44.17 arc-45 41.3,44.09 32.62,44.09 arc-45 32.44,44.17 32.27,44.34 v32.21,44.4
MISO3  (via drill 0.35)
  Top 0.406: v11.33,26.11 13.05,27.83 arc45 13.12,28.01 R69.2 13.12,29.6 arc45 13.05,29.78 12.95,29.87 v13.06,29.87 | v10.11,39.22 10.11,39.72 arc45 10.04,39.9 9.14,40.79 9.14,41.55 arc45 9.07,41.73 JP3.5
  Bottom 0.305: JP3.5 8.92,44.48 arc-45 9.1,44.55 12.65,44.55 arc45 12.82,44.63 13.04,44.84 arc45 13.11,45.02 U1.7 13.11,48.11 arc-45 13.19,48.29 16,51.11 arc-45 16.18,51.18 16.74,51.18 18.9,53.34 arc-45 19.08,53.42 19.63,53.42 | 19.63,53.42 arc-45 19.64,53.39 U4.7 | 19.63,53.42 22.12,53.42 arc-45 22.3,53.34 22.96,52.68 arc-45 23.04,52.5 23.04,52.09 23.57,51.56 arc45 23.75,51.49 24.69,51.49 24.83,51.62 arc45 24.9,51.8 U2.7
  Bottom 0.406: IC9.22 11.8,25.39 arc-45 11.62,25.46 11.4,25.68 arc-45 11.33,25.86 v11.33,26.11 11.33,26.16 | v10.11,39.22 10.04,39.28 arc-45 10.01,39.37 10.29,39.09 arc-45 10.36,38.91 10.36,37.29 11.12,36.52 11.12,32.01 arc45 11.2,31.83 11.28,31.75 arc45 11.35,31.58 v13.06,29.87
MOSI3  (via drill 0.35)
  Top 0.305: v22.55,51.31 arc90 22.3,51.56 20.62,51.56 arc90 20.32,51.87 18.65,51.87 arc90 v18.21,51.43
  Top 0.406: v9.14,38.35 9.14,39.01 arc45 9.07,39.19 JP3.3
  Bottom 0.305: JP3.3 arc-45 7.66,40.73 9.2,42.27 9.2,43.28 arc-45 9.27,43.46 9.65,43.84 12.8,43.84 arc45 12.98,43.91 13.54,44.48 arc45 13.61,44.66 U1.8 13.61,47.8 arc-45 13.69,47.98 16.23,50.52 arc-45 16.41,50.6 18.09,50.6 | U4.8 20.14,51.09 arc-45 20.07,50.91 19.84,50.67 arc-45 19.66,50.6 18.09,50.6 | U2.8 25.4,51.16 25.09,50.85 arc-45 24.91,50.77 23.16,50.77 22.65,51.29 arc45 22.61,51.31 v22.55,51.31 | v18.21,51.43 18.21,50.72 arc-90 18.09,50.6
  Bottom 0.406: IC9.3 16.37,25.39 arc-45 16.2,25.46 14.17,27.48 12.4,27.48 arc-45 12.22,27.56 9.17,30.61 arc-45 9.09,30.79 9.09,36.22 arc-45 9.13,36.31 v9.14,38.35
N$1
  Top 0.61: IC1.2 67.38,27.25 arc90 66.8,26.67 arc90 67.49,25.98 IC1.1 68.05,25.98 arc-90 68.3,25.73 C2.2 68.3,22.04 arc-90 R4.1
N$2
  Top 0.61: 66.37,34.22 66.99,33.6 IC1.7 | IC1.6 66.85,32.33 66.37,32.81 66.37,34.22 | 66.37,34.22 66.37,35.04 | 66.37,35.04 arc45 66.3,35.22 | C7.2 arc-45 67.61,36.28 66.37,35.04 | 66.37,35.04 R8.1
N$3
  Top 0.61: IC2.9 52.58,11.54 arc45 52.65,11.36 52.83,11.18 52.83,10.15 arc-45 R21.2 52.83,8.51 arc-45 R20.1
N$4
  Top 0.61: IC1.3 69.23,28.52 arc-45 69.41,28.45 70.14,27.72 | 70.14,27.72 R2.2 | C61.2 70.21,27.75 arc45 70.14,27.72
N$5
  Top 0.61: R5.1 arc90 66.04,23.64 R4.2 62.82,21.64 arc-90 C3.1
N$6
  Top 0.61: R70.2 arc90 58.21,24.36 56.9,24.36 | 56.9,24.36 R13.2 | IC2.3 56.39,18.44 arc-45 56.46,18.62 56.9,19.05 56.9,24.36
N$7
  Top 0.61: IC1.5 69.24,31.06 arc45 69.42,31.13 C6.1 71.68,32.07 arc45 71.86,32.14 R6.2
N$8
  Top 0.61: R7.2 arc90 74.25,34.63 R6.1 72.64,35.45 arc45 72.57,35.63 71.96,36.25 arc45 71.78,36.32 C7.1
N$9
  Top 0.61: R11.2 R10.1 58.08,19.07 arc-45 58,18.89 57.66,18.54 IC2.2
N$10
  Top 0.61: R8.2 65.53,38.25 arc45 65.46,38.43 64.84,39.04 arc45 64.67,39.12 62.74,39.12 62.22,38.59 arc45 62.14,38.41 R9.1 60.71,37.59 59.26,36.14 arc45 59.18,35.96 C8.1
N$11
  Top 0.61: R9.2 63.84,36.07 arc-45 63.77,35.89 C9.2 64.19,34.81 arc-45 64.26,34.63 64.26,31.5 63.9,31.13 arc-45 63.72,31.06 IC1.10
N$12
  Top 0.508: R14.2 52.73,23.79 arc-45 52.91,23.71 53.04,23.58
  Top 0.61: IC2.5 53.85,19.45 arc45 53.77,19.63 53.34,20.07 53.34,23.18 arc45 53.27,23.35 53.04,23.58 R15.2
N$13
  Top 0.61: IC2.6 52.58,19.29 arc45 52.5,19.47 R17.1 R16.2
N$14
  Top 0.61: 62.99,28.52 IC1.12 | 62.99,28.52 63.46,28.52 64.27,27.71 64.27,24.02 arc90 R5.2 | C4.1 61.21,28.45 arc-90 61.29,28.52 62.99,28.52
N$15
  Top 0.61: IC2.13 57.66,11.37 arc45 57.73,11.19 R24.2 | IC2.13 57.66,10.86 arc-45 57.58,10.68 R23.2 | R22.2 58.84,13.79 arc-45 58.66,13.72 58.17,13.72 57.73,13.28 arc45 57.66,13.1 IC2.13
N$16  (via drill 0.35)
  Top 0.305: v44.96,19 47.29,19 arc45 R25.2
  Bottom 0.305: U1.3 13.61,40.29 arc45 13.69,40.11 15.32,38.48 arc45 15.5,38.41 17.04,38.41 19.34,36.11 | 19.34,36.11 19.59,35.86 | 44.96,18.95 v44.96,19 44.96,19.76 arc45 44.88,19.94 29.16,35.66 19.89,35.66 arc-45 19.71,35.74 19.34,36.11
N$17  (via drill 0.35)
  Top 0.305: v45.97,17.93 47.42,16.48 arc-45 47.5,16.3 R26.2
  Bottom 0.305: U1.2 14.11,40.55 arc45 14.19,40.37 15.6,38.96 17.7,38.96 17.86,38.8 arc-45 17.88,38.76 20.3,36.35 arc45 20.48,36.27 29.36,36.27 arc-45 29.54,36.2 45.9,19.84 arc-45 45.97,19.66 v45.97,17.93
N$18  (via drill 0.35)
  Bottom 0.305: U1.5 10.97,41.59 arc-45 C15.2
  other vias: 10.84,41.64
N$19
  Top 0.61: R27.2 46.39,13.13 arc45 46.21,13.21 IC3.5
N$20
  Top 0.61: IC3.14 36.66,8.13 arc90 R28.2 33.47,8.04 arc-45 33.29,8.11 30.73,10.67 IC4.3
N$21
  Top 0.61: IC3.13 37.34,9.4 37.07,9.67 arc45 36.89,9.74 R28.1 R29.2
N$22
  Top 0.61: C18.1 29.65,8.09 arc45 IC4.1 IC4.2
N$23
  Top 0.61: IC4.6 IC4.7 arc-45 29.63,15.77 C20.1
N$24
  Top 0.61: IC7.2 IC7.1 35.49,24.47 arc45 35.31,24.39 35.05,24.13 34.2,24.13 arc45 C27.2 R36.2
N$25  (via drill 0.35)
  Top 0.457: v11.46,23.44 14.87,23.44 arc45 15.05,23.52 R64.1
  Bottom 0.457: IC9.19 11.44,23.44 arc-90 11.43,23.44 v11.46,23.44
N$26
  Top 0.508: R33.2 15.49,16.26 16.09,15.66 arc45 16.27,15.58 R32.1
N$27
  Top 0.61: C30.1 37.08,20.72 arc-45 37.16,20.9 37.34,21.08 37.34,21.91 arc-45 37.41,22.08 | 37.41,22.08 R34.1 | IC7.3 38.61,22.86 37.91,22.16 arc-45 37.73,22.08 37.41,22.08
N$28
  Top 0.61: R35.1 34.8,22.1 arc45 34.64,22.16 C27.1 arc45 34.2,22.1 R34.2
N$29
  Top 0.61: R37.2 32.26,25.82 arc90 32,25.57 R36.1 32.26,25.49 arc90 32.51,25.74 32.51,32.41 arc-45 32.59,32.59 33.02,33.02 33.74,33.02 arc45 33.92,33.09 C28.1
N$30
  Top 0.61: 46.53,24.04 R40.2 | 46.53,24.04 arc-45 C33.2 | IC7.6 IC7.7 44.01,24.47 arc-45 44.19,24.39 44.45,24.13 46.34,24.13 arc-45 46.52,24.06 46.53,24.04
N$31
  Top 0.61: R39.1 R38.2 45.36,20.07 arc45 45.54,20.14 46.48,21.08 C33.1
N$32
  Top 0.61: R44.2 22.02,40.04 arc-45 22.19,39.97 C37.2 arc-45 22.77,39.62 23.62,39.62 23.97,39.27 arc45 24.15,39.2 IC8.1 IC8.2
N$33
  Top 0.61: IC7.5 41.15,22.61 41.58,22.17 arc45 41.76,22.1 C32.1 42.15,21.76 arc45 42.08,21.59 R38.1
N$34
  Top 0.61: 47.5,25.74 R40.1 | 47.5,25.74 45.9,25.74 arc-45 R41.2 | C35.1 48.01,29.82 arc-45 47.93,29.64 47.5,29.21 47.5,25.74
N$35
  Top 0.61: IC7.10 41.15,29.19 arc45 41.22,28.75 42.09,27.76 arc45 42.27,27.69 44.02,27.69 | 44.02,27.69 arc45 44.2,27.76 C34.1 | R41.1 45.63,27.61 arc45 45.45,27.69 44.02,27.69
N$36
  Top 0.61: IC8.3 27.18,38.17 arc-45 27.1,37.99 R42.1 26.6,36.23 arc-45 26.67,36.05 C40.1
N$37
  Top 0.61: C37.1 23.34,36.93 arc45 23.52,36.85 R42.2 24.27,35.61 arc45 24.34,35.43 R43.1
N$38
  Top 0.61: R45.2 21.23,41.67 arc45 21.05,41.74 R44.1 19.56,45.21 19.99,45.65 arc-45 20.17,45.72 C38.1
N$39
  Top 0.61: 32,39.2 IC8.7 32.77,39.2 arc-45 32.95,39.12 C43.2 | 32,39.2 IC8.6 | R48.2 33.34,39.27 arc-45 33.16,39.2 32,39.2
N$40
  Top 0.61: R47.1 32.36,33.97 arc-45 32.51,34.04 32.42,34.13 arc-45 32.35,34.31 R46.2 32.91,34.54 arc45 33.09,34.62 33.96,35.23 arc45 34.29,35.92 C43.1
N$41
  Top 0.61: IC8.5 29.72,37.26 arc45 29.79,37.08 C42.1 30.04,36.36 arc45 30.11,36.18 30.23,36.07 30.23,34.96 arc90 R46.1
N$42
  Top 0.508: 35.72,42.83 35.89,43 arc45 35.97,43.18 35.97,44.25 36.3,44.58 arc45 36.37,44.76 C45.1
  Top 0.61: R48.1 R49.2 35.65,42.66 arc-45 35.72,42.83 35.81,42.93
N$43
  Top 0.61: IC8.10 29.72,43.18 30.66,42.24 arc45 30.84,42.16 R49.1 33.95,43.81 arc-45 34.02,43.99 C44.1
N$44  (via drill 0.35)
  Top 0.457: U3.2 40.38,48 arc-45 40.2,48.08 R50.1 arc45 39.73,48.73 39.73,49.17 arc45 39.71,49.14 R52.1
  other vias: 39.71,49.09
N$45  (via drill 0.35)
  Top 0.457: U3.3 40.22,47.34 arc45 40.04,47.27 R50.2
  Bottom 0.457: R51.1 arc45 39.67,46.95 R50.2
  other vias: 39.67,46.9
N$46  (via drill 0.35)
  Top 0.305: v30.58,46.23 32.64,48.29 arc-45 32.82,48.36 v36.58,48.36
  Bottom 0.305: U2.3 25.4,47.2 arc45 25.47,47.02 26.11,46.38 27.89,46.38 | 27.89,46.38 28.34,46.38 | 27.89,46.38 30.18,46.38 arc-90 30.33,46.23 v30.58,46.23 | v36.58,48.36 37.18,48.36 arc45 37.36,48.44 R52.2
N$47
  Bottom 0.305: U2.2 25.9,47.46 arc45 25.97,47.28 26.14,47.12 arc45 26.32,47.04 27.69,47.04 | 27.69,47.04 28.14,47.04 | 27.69,47.04 37.94,47.04 arc-90 R51.2
N$48
  Top 0.406: U6.2 40.97,44.07 arc-45 40.79,44.14 40.44,44.5 39.87,44.5 arc-45 39.69,44.58 R56.1
N$49  (via drill 0.35)
  Top 0.305: C49.1 23.95,50.19 arc45 23.88,50.01 v23.88,48.51 | v23.88,48.51 23.88,48.41 v23.88,48.51
  Bottom 0.305: U2.5 24.21,48.44 arc45 24.03,48.51 v23.88,48.51
N$50  (via drill 0.35)
  Top 0.457: U5.2 50.62,40.1 arc-45 50.7,40.28 51.07,40.65 arc45 51.14,40.83 R53.1
  Bottom 0.457: R55.1 50.52,39.4 arc45 50.6,39.58 50.6,40.08 51.03,40.52 arc45 51.1,40.69 51.1,41.15 R53.1
  other vias: 51.14,41.15
N$51
  Top 0.254: U9.10 arc-45 68.52,15.04 69.19,15.04 69.32,15.17 arc-45 69.5,15.24 69.8,15.24
  Top 0.508: C64.1 70.36,15.7 arc45 70.18,15.62 69.8,15.24
N$52
  Bottom 0.254: U4.3 20.14,46.76 arc45 20.22,46.58 24.82,41.98 arc45 25,41.91 36.7,41.91 37.52,41.09 arc45 37.7,41.02 42.67,41.02 42.95,40.74 arc45 43.08,40.69
  Bottom 0.457: 43.08,40.69 43.4,40.37 arc-45 43.43,40.28 45.87,40.28 46.05,40.1 arc-45 46.13,39.92 46.13,39.57 46.63,39.07 arc45 46.81,38.99 R55.2
N$53
  Bottom 0.254: U4.2 20.64,47.15 arc45 20.72,46.97 20.95,46.74 21.61,46.74 arc-45 21.79,46.66 22.1,46.35
  Bottom 0.406: 44.05,41.09 43.31,41.84 arc45 43.13,41.91 37.97,41.91 37.41,42.47 arc45 37.23,42.55 26.01,42.55 arc-45 25.83,42.62 22.1,46.35
  Bottom 0.457: 43.33,41.6 arc-45 43.51,41.53 43.87,41.17 arc45 44.05,41.09 R54.2
N$54
  Top 0.406: U6.3 40.97,43.41 arc45 40.79,43.33 40.44,42.98 39.87,42.98 arc45 39.69,42.9 R56.2
N$55  (via drill 0.35)
  Bottom 0.305: U4.5 18.83,47.96 arc45 18.65,47.89 C52.1
  other vias: 18.62,47.86
N$56
  Top 0.457: 36.97,37.95 arc-45 R57.1 arc45 36.86,37.92 U7.2
N$57
  Top 0.61: C18.2 27.48,6.36 arc45 27.3,6.44 R30.1 25.83,6.62 arc45 25.91,6.8 25.91,10.16 25.47,10.59 arc45 25.3,10.67 IC4.12
N$58
  Top 0.457: U7.3 38.13,37.26 arc45 37.95,37.19 37.07,36.31 arc-45 36.89,36.23 R57.2
N$60  (via drill 0.35)
  Top 0.457: v11.43,22.1 R65.1
  Bottom 0.457: IC9.17 11.52,22.14 arc45 v11.43,22.1
N$61  (via drill 0.35)
  Top 0.457: v11.43,20.83 13.87,20.83 arc-45 14.04,20.75 14.73,20.07 R66.1
  Bottom 0.457: IC9.15 11.45,20.84 arc45 v11.43,20.83
N$62  (via drill 0.35)
  Top 0.457: v11.43,19.56 13.36,19.56 arc-45 13.54,19.48 14.99,18.03 R67.1
  Bottom 0.457: IC9.13 11.48,19.54 arc-45 v11.43,19.56
N$63  (via drill 0.35)
  Bottom 0.457: IC9.6 20.03,23.44 arc45 20.21,23.51 20.83,24.13 C27C0G.2
  other vias: 20.74,24.13
N$64
  Bottom 0.254: U8.10 24.73,26.21 arc-90 C60.1
N$65
  Bottom 0.254: U8.9 25.66,25.71 arc45 25.38,25.63 25.04,25.3 23.52,25.3 C60.2
N$66  (via drill 0.35)
  Bottom 0.457: IC9.8 20.57,22.1 C28C0G.2
  other vias: 20.74,22.1
N$67  (via drill 0.35)
  Bottom 0.457: IC9.10 19.95,20.84 arc-45 20.13,20.76 20.83,20.07 C29C0G.2
  other vias: 20.74,20.07
N$68  (via drill 0.35)
  Bottom 0.457: IC9.12 19.47,19.54 arc-45 19.65,19.46 20.75,18.36 arc-45 20.83,18.18 20.83,18.03 R68.2
  other vias: 20.74,18.03
N$69
  Top 0.61: C20.2 arc45 27.6,17.96 26.67,17.96 | 26.67,17.96 R31.1 | IC4.10 25.91,13.21 26.6,13.9 arc45 26.67,14.07 26.67,17.96
N$70
  Top 0.254: U9.9 72.9,14.53 arc45 73.08,14.61 73.3,14.83 73.3,15.51 arc-45 73.38,15.69 C64.2
N$71
  Top 0.254: U9.2 66.16,15.53 arc-45 65.98,15.61 65.61,15.98 arc45 65.43,16.05 65.15,16.05 R71.1
  Top 0.508: R72.2 64.9,16.41 arc45 64.97,16.23 65.15,16.05
N$72
  Top 0.61: R18.2 R19.2 | R19.2 49.54,14.3 arc45 49.72,14.22 53.09,14.22 53.77,13.54 arc-45 53.85,13.36 IC2.10 | R19.2 R19.2 arc45 49.35,14.39 R26.1
N$73  (via drill 0.35)
  Top 0.254: U9.1 66.61,17.68 arc-90 R12.1
  Bottom 0.508: R1.2 R12.1
  other vias: 66.71,17.78
N$74
  Top 0.61: R3.2 R2.1 C2.1
N$75
  Top 0.508: IC7.12 38.61,29.11 arc-45 38.53,28.93 38.07,28.47 arc-45 37.89,28.4 35.05,28.4 arc-45 34.93,28.35 34.04,28.35
  Top 0.61: C29.2 34.04,28.35 R37.1
N$76
  Top 0.61: R45.1 22.87,41.74 arc-45 22.79,41.91 22.79,42.93 | 22.79,42.93 C39.2 | IC8.12 27.18,43.54 arc-45 27.1,43.36 26.67,42.93 22.79,42.93
N$77  (via drill 0.35)
  Top 0.457: U5.3 49.96,40.1 arc45 49.89,40.28 49.52,40.65 arc-45 49.44,40.83 R53.2
  Bottom 0.457: R54.1 arc45 49.42,41.13 R53.2
  other vias: 49.44,41.15
N$78
  Bottom 0.254: U8.2 29.45,26.71 arc45 R60.1
  Bottom 0.508: R61.2 29.06,29.01 29.4,28.66 arc-45 29.48,28.48 R60.1
N$79  (via drill 0.35)
  Top 0.508: R58.2 29.22,27.76 arc45 29.3,27.58 R59.1 29.17,27.71 arc45 28.99,27.79 v28.5,27.79
  Bottom 0.254: 28.17,27.21 U8.1 28.02,27.21 arc45 28.2,27.28 28.5,27.58 v28.5,27.79 28.5,27.84
N$80  (via drill 0.35)
  Top 0.254: C58.1 29.57,24.01 arc45 v29.62,24.13
  Bottom 0.254: U8.5 28.38,25.21 arc-45 28.56,25.13 29.26,24.43 arc45 29.38,24.13 v29.62,24.13 29.57,24.38
N$81
  Bottom 0.254: U8.7 arc90 26.06,24.69 26.06,23.08 arc90 R62.1
  Bottom 0.508: R62.1 R63.1
N$82
  Top 0.254: U9.5 66.26,14.03 arc45 66.08,13.96 65.99,13.87 64.15,13.87 arc-45 63.97,13.94 C62.1
N$83
  Top 0.254: U9.7 68.51,12.14 68.51,12.09 arc-45 68.44,11.91 R73.1
  Top 0.508: R74.1 70.15,12.22 arc-45 69.97,12.14 68.51,12.14
N$84  (via drill 0.35)
  other vias: 55.42,41.96
RE  (via drill 0.35)
  Top 0.61: R27.1 46.39,10.74 arc-45 v46.21,10.67 IC3.3
  Bottom 0.406: TP_RE.TP 7.11,5.69 arc45 7.19,5.51 7.87,4.83
  Bottom 0.508: X1.2 5.55,13.57 arc45 5.37,13.5 4.65,12.77 arc45 4.57,12.6 4.57,8.13 7.87,4.83 8.56,4.14 arc45 8.74,4.06 44.45,4.06 46.15,5.77 arc45 46.23,5.95 46.23,10.67 v46.21,10.67
RE1  (via drill 0.35)
  Top 0.406: TP_RE1.TP TP_RE1.TP arc45 44.37,15.56 44.37,14.99
  Top 0.61: R29.1 arc-90 37,13.21 IC3.10 41.04,13.21 arc45 41.22,13.28 42.42,14.48 IC3.6 44.37,14.99 IC3.7
  other vias: 44.45,15.75
RE_OP
  Top 0.61: IC3.2 IC3.1 47.24,8.13 48.44,6.93 arc-45 48.51,6.75 48.51,5.33 49.71,4.14 arc45 49.89,4.06 57.66,4.06 58.85,5.26 arc45 58.93,5.44 R24.1
SCLK3  (via drill 0.35)
  Top 0.406: v10.11,36.07 8.79,36.07 arc-45 8.61,36.14 8.03,36.73 8.03,37.59 arc45 7.95,37.77 JP3.1
  Bottom 0.305: JP3.1 9.93,40.41 arc45 10.01,40.59 10.01,42.62 10.49,43.11 arc-45 10.67,43.18 12.34,43.18 13.05,43.18 | 13.05,43.18 13.11,43.18 | 13.05,43.18 arc45 13.23,43.25 14.12,44.15 14.12,45.88 arc90 U1.9 14.11,47.49 arc-45 14.19,47.67 16.49,49.96 arc-45 16.67,50.04 17.48,50.04 | 17.48,50.04 17.68,50.04 | U4.9 20.64,50.72 arc-45 20.57,50.54 20.14,50.11 arc-45 19.96,50.04 19.51,50.04 | 19.51,50.04 17.48,50.04 | U2.9 25.9,50.69 arc-45 25.83,50.51 25.68,50.37 | 25.68,50.37 25.45,50.14 | 19.51,50.04 25.24,50.04 arc45 25.42,50.11 25.68,50.37
  Bottom 0.406: IC9.1 18.23,27.2 arc45 18.05,27.28 15.54,27.28 14.65,28.17 arc45 14.47,28.25 12.65,28.25 9.98,30.91 arc-45 9.91,31.09 9.91,35.95 arc-45 9.96,36.07 v10.11,36.07
SYNC#1  (via drill 0.35)
  Top 0.305: v11.79,45.72 13.76,45.72 arc-45 13.94,45.65 v14.88,44.76 14.94,44.7
  Bottom 0.305: JP3.7 v11.79,45.72 11.84,45.72 | U1.10 14.61,45.08 arc45 14.69,44.9 v14.88,44.76
SYNC#2  (via drill 0.35)
  Top 0.305: v21.41,52.32 arc45 v21.41,52.32 21.34,52.3 20.9,52.3 arc45 20.72,52.38 17.65,52.36 arc-90 17.65,52.35 v16.56,52.35
  Bottom 0.305: JP3.9 9.45,48.26 arc45 9.62,48.33 13.59,52.3 arc-45 13.77,52.38 v16.56,52.35 | v21.41,52.32 21.17,52.31 arc-45 21.14,51.86 U4.10
SYNC#3
  Bottom 0.406: IC9.24 12.03,26.69 arc-45 11.85,26.76 8.13,30.48 8.13,34.95 arc45 8.05,35.13 JP3.2
SYNC#6  (via drill 0.35)
  Top 0.305: v17.32,53.29 22.86,53.29 arc45 23.04,53.36 23.21,53.54 arc-45 v23.37,53.61
  Bottom 0.305: JP3.10 6.63,49.81 arc-45 6.81,49.89 8.23,49.89 11.56,53.22 arc-45 11.74,53.29 v17.32,53.29 | v23.37,53.61 23.48,53.72 arc-45 23.66,53.8 26.06,53.8 26.33,53.53 arc-45 26.4,53.35 U2.10
TIA_OUT  (via drill 0.35)
  Top 0.457: R67.2 R66.2 R65.2 R64.2 | R68.1 C29C0G.1 C28C0G.1 C27C0G.1
  Top 0.508: 14.35,12.45 IC5.6 | 14.35,12.45 14.35,14.08 arc-45 C23.1 | 14.35,12.45 15.71,13.81 arc-45 15.89,13.88 R32.2 arc-90 16.6,13.97 18.54,13.97 21.34,13.97 v22.1,13.97
  Top 0.61: v27.94,13.21 IC4.5 | R67.2 18.48,16.91 arc-45 18.54,16.76 18.54,13.97 | R68.1 22.44,17.21 arc-45 22.37,17.03 21.34,16 21.34,13.97 | C27C0G.1 22.44,24.95 arc45 22.37,25.13 20.57,26.92 20.57,33.78 21.14,34.34 arc-45 21.31,34.42 IC10.3
  Bottom 0.61: v22.1,13.97 22.79,13.28 arc45 22.96,13.21 v27.94,13.21
U
  Top 0.305: U5.7 50.62,36.04 arc-45 50.7,36.22 50.93,36.45 arc-45 51.11,36.52 56.29,36.52 59.51,39.75 arc-45 59.69,39.83 72.34,39.83 arc-90 72.39,39.78
  Top 0.61: JP6.2 72.39,39.78 JP6.4
U_CV
  Top 0.457: U7.7 44.62,37.92 arc-45 44.8,37.85 45.34,37.31 | 45.34,37.31 45.52,37.13 | JP6.10 67.26,48.26 arc45 67.08,48.19 56.03,37.13 45.62,37.13 arc-45 45.44,37.21 45.34,37.31
U_CV_W/ODC
  Top 0.61: IC3.9 IC3.8 36.68,15.75 arc-45 36.5,15.82 34.8,17.53 R35.2
U_CV_W/ODC_FILTER  (via drill 0.35)
  Top 0.457: U7.4 37.59,35.31 36.08,33.79 arc45 36,33.61 C28.2
  Top 0.508: IC7.14 IC7.13 37.34,31.83 arc45 37.26,32.01 C28.2
  Bottom 0.406: TP_U_CV.TP C28.2
  other vias: 36,33.27
U_IS_W/ODC  (via drill 0.35)
  Top 0.61: IC4.14 IC4.13 v22.86,9.4
  Bottom 0.61: v22.86,9.4 31.9,9.4 arc45 32.08,9.47 34.47,11.86 arc45 34.54,12.04 34.54,15.24 37.26,17.96 arc-45 37.44,18.03 R39.2
  other vias: 42.08,18.03
U_IS_W/ODC_FILTER  (via drill 0.35)
  Top 0.457: IC7.8 43.69,31.9 arc-45 43.76,32.08 44.31,32.63 arc-45 44.49,32.7 C35.2 | v53.65,38.1 51.94,37.92 arc-45 51.76,37.85 49.78,37.85 49.4,38.23 arc-45 49.33,38.41 U5.4
  Top 0.61: IC7.9 IC7.8
  Bottom 0.406: TP_U_IS.TP v53.65,38.1
  Bottom 0.457: C35.2 49.27,33.96 arc-45 49.45,34.04 51.41,34.04 52.3,34.93 arc45 52.38,35.11 53.65,35.05 v53.65,38.1
  other vias: 48.01,32.7
WE  (via drill 0.35)
  Top 0.61: IC5.8 v11.81,12.7 11.81,12.91 arc-45 11.88,13.09 C23.2 arc90 12.61,13.82 R33.1
  Bottom 0.457: IC9.14 14.22,20.19 | 14.22,20.19 IC9.11 | IC9.9 14.22,21.49 | 14.22,21.49 IC9.16 | IC9.7 14.22,22.79 | 14.22,22.79 IC9.18 | IC9.20 14.22,24.09 | 14.22,24.09 IC9.5 | 14.22,24.09 14.22,22.79 | 14.22,22.79 14.22,21.49 | 14.22,21.49 14.22,20.19 | 14.22,20.19 14.22,18.9 arc-45 14.15,18.72 13.59,18.16 | 13.59,18.16 13.46,18.03 | 13.59,18.16 12.7,17.53 12.7,16.26 R33.1
  Bottom 0.508: X1.1 11.74,12.77 arc-90 v11.81,12.7
  other vias: 12.61,16.26